# EAGLE schematic nrf52_dev (EAGLE 9.6.2)
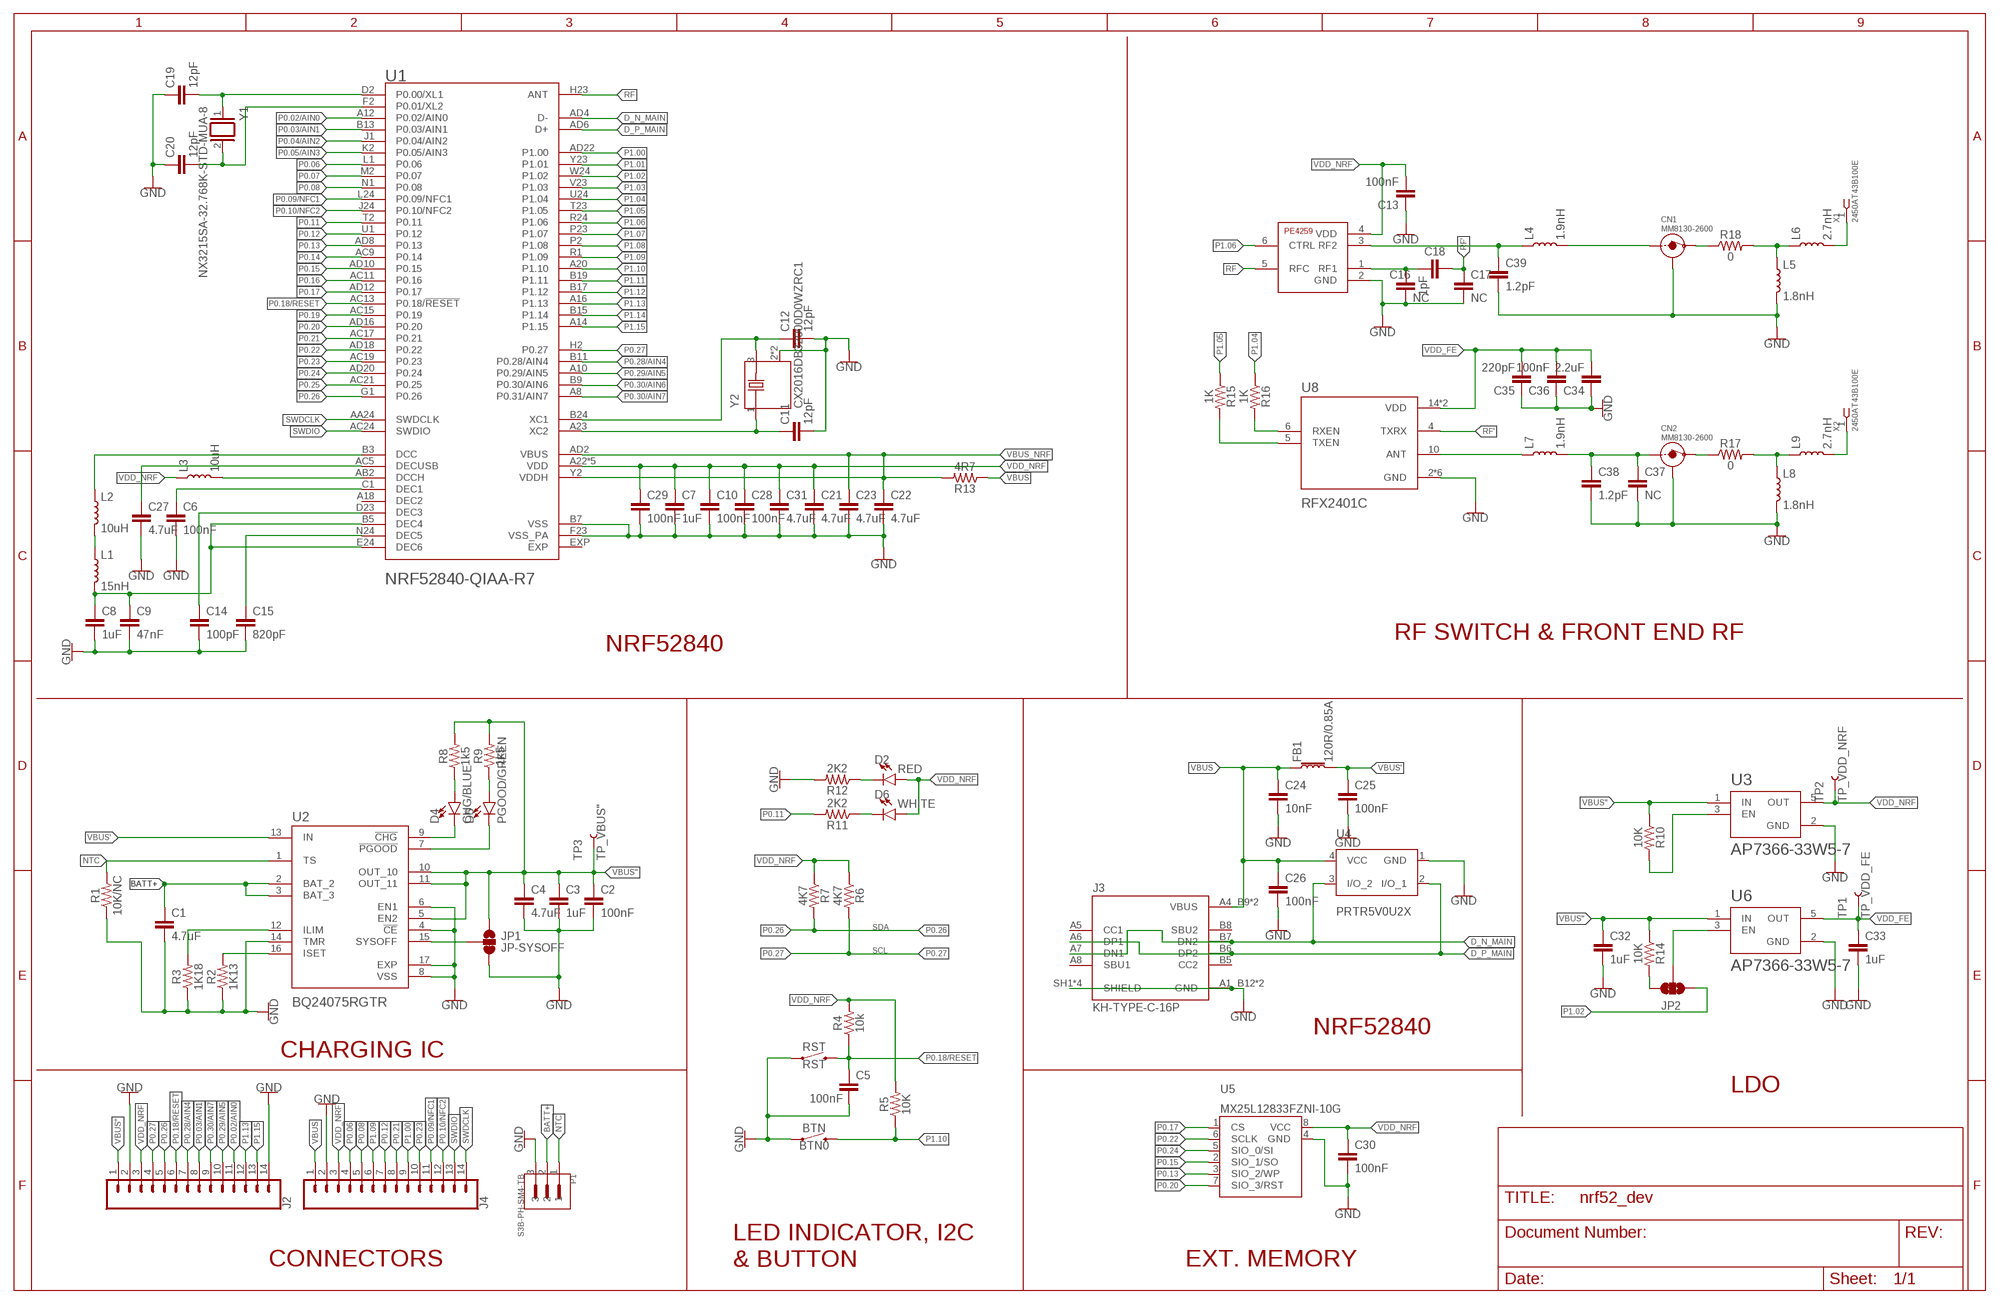
[diagram p0: schematic, sheet 1]

## Parts
BTN  BTN0  MOMENTARY-SWITCH-SPST-SMD-6.0X3.5MM  [TACTILE_SWITCH_SMD_6.0X3.5MM]
C1  4.7uF  4.7UF-0805-50V-(10%)  [0805]
C2  100nF  0.1UF-0603-25V-(+80/-20%)  [0603]
C3  1uF  0.1UF-0603-25V-(+80/-20%)  [0603]
C4  4.7uF  4.7UF-0805-50V-(10%)  [0805]
C5  100nF  0.1UF-0402-10V-10%-X7R  [0402]
C6  100nF  0.1UF-0402-10V-10%-X7R  [0402]
C7  1uF  0.1UF-0402-10V-10%-X7R  [0402]
C8  1uF  0.1UF-0402-10V-10%-X7R  [0402]
C9  47nF  0.1UF-0402-10V-10%-X7R  [0402]
C10  100nF  0.1UF-0402-10V-10%-X7R  [0402]
C11  12pF  0.1UF-0603-25V-(+80/-20%)  [0603]
C12  12pF  0.1UF-0603-25V-(+80/-20%)  [0603]
C13  100nF  0.1UF-0402-10V-10%-X7R  [0402]
C14  100pF  0.1UF-0402-10V-10%-X7R  [0402]
C15  820pF  0.1UF-0402-10V-10%-X7R  [0402]
C16  NC  0.1UF-0402-10V-10%-X7R  [0402]
C17  NC  0.1UF-0402-10V-10%-X7R  [0402]
C18  1pF  0.1UF-0603-25V-(+80/-20%)  [0603]
C19  12pF  0.1UF-0402-10V-10%-X7R  [0402]
C20  12pF  0.1UF-0402-10V-10%-X7R  [0402]
C21  4.7uF  0.1UF-0402-10V-10%-X7R  [0402]
C22  4.7uF  0.1UF-0402-10V-10%-X7R  [0402]
C23  4.7uF  0.1UF-0402-10V-10%-X7R  [0402]
C24  10nF  0.1UF-0402-10V-10%-X7R  [0402]
C25  100nF  0.1UF-0402-10V-10%-X7R  [0402]
C26  100nF  0.1UF-0402-10V-10%-X7R  [0402]
C27  4.7uF  0.1UF-0603-25V-(+80/-20%)  [0603]
C28  100nF  0.1UF-0402-10V-10%-X7R  [0402]
C29  100nF  0.1UF-0402-10V-10%-X7R  [0402]
C30  100nF  0.1UF-0402-10V-10%-X7R  [0402]
C31  4.7uF  0.1UF-0402-10V-10%-X7R  [0402]
C32  1uF  0.1UF-0603-25V-(+80/-20%)  [0603]
C33  1uF  0.1UF-0603-25V-(+80/-20%)  [0603]
C34  2.2uF  0.1UF-0402-10V-10%-X7R  [0402]
C35  220pF  0.1UF-0402-10V-10%-X7R  [0402]
C36  100nF  0.1UF-0402-10V-10%-X7R  [0402]
C37  NC  0.1UF-0402-10V-10%-X7R  [0402]
C38  1.2pF  0.1UF-0402-10V-10%-X7R  [0402]
C39  1.2pF  0.1UF-0402-10V-10%-X7R  [0402]
CN1  MM8130-2600  [MM8130-2600]
CN2  MM8130-2600  [MM8130-2600]
D2  RED  LED0603  [LED-0603]
D4  CHG/BLUE  LED0603  [LED-0603]
D5  PGOOD/GREEN  LED0603  [LED-0603]
D6  WHITE  LED0603  [LED-0603]
FB1  120R/0.85A  FERRITE_BEAD  [0402]
J2  CONN_14NO_SILK  [1X14_NO_SILK]
J3  KH-TYPE-C-16P  [KINGHELM_KH-TYPE-C-16P]
J4  CONN_14NO_SILK  [1X14_NO_SILK]
JP1  JP-SYSOFF  JUMPER-SMT_3_1-NC_TRACE_SILK  [SMT-JUMPER_3_1-NC_TRACE_SILK]
JP2  JP_EN1  JUMPER-SMT_3_1-NC_TRACE_SILK  [SMT-JUMPER_3_1-NC_TRACE_SILK]
L1  15nH  INDUCTOR-0402-3.9NH  [0402]
L2  10uH  39NH-0603  [0603]
L3  10uH  39NH-0603  [0603]
L4  1.9nH  INDUCTOR-0402-3.9NH  [0402]
L5  1.8nH  39NH-0603  [0603]
L6  2.7nH  39NH-0603  [0603]
L7  1.9nH  INDUCTOR-0402-3.9NH  [0402]
L8  1.8nH  39NH-0603  [0603]
L9  2.7nH  39NH-0603  [0603]
P1  S3B-PH-SM4-TB  [JST_S3B-PH-SM4-TB]
R1  10K/NC  RESISTOR0603  [0603]
R2  1K13  RESISTOR0603  [0603]
R3  1K18  RESISTOR0603  [0603]
R4  10k  RESISTOR0402  [0402]
R5  10K  RESISTOR0402  [0402]
R6  4K7  0OHM-0402-1/10W  [0402]
R7  4K7  0OHM-0402-1/10W  [0402]
R8  1k5  0OHM-0402-1/10W  [0402]
R9  1k5  0OHM-0402-1/10W  [0402]
R10  10K  RESISTOR0603  [0603]
R11  2K2  0OHM-0402-1/10W  [0402]
R12  2K2  0OHM-0402-1/10W  [0402]
R13  4R7  RESISTOR0603  [0603]
R14  10K  RESISTOR0603  [0603]
R15  1K  0OHM-0402-1/10W  [0402]
R16  1K  0OHM-0402-1/10W  [0402]
R17  0  0OHM-0402-1/10W  [0402]
R18  0  0OHM-0402-1/10W  [0402]
RST  RST  MOMENTARY-SWITCH-SPST-SMD-6.0X3.5MM  [TACTILE_SWITCH_SMD_6.0X3.5MM]
TP1  TP_VDD_FE  TEST-POINT3X4  [PAD.03X.04]
TP2  TP_VDD_NRF  TEST-POINT3X4  [PAD.03X.04]
TP3  TP_VBUS''  TEST-POINT3X4  [PAD.03X.04]
U1  NRF52840-QIAA-R7  [NORDIC_NRF52840-QIAA-R7]
U2  BQ24075RGTR  [QFN50P300X300X100-17N]
U3  AP7366-33W5-7  [SOT95P285X140-5N]
U4  PRTR5V0U2X  [SOT190P230X110-4N]
U5  MX25L12833FZNI-10G  [SON127P500X600X80-9N]
U6  AP7366-33W5-7  [SOT95P285X140-5N]
U7  PE4259  [SOT65P210X110-6N]
U8  RFX2401C  [QFN50P300X300X60-17N]
X1  2450AT43B100E  [2450AT43B100]
X2  2450AT43B100E  [2450AT43B100]
Y1  NX3215SA-32.768K-STD-MUA-8  [XTAL_NX3215SA-32.768K-STD-MUA-8]
Y2  CX2016DB32000D0WZRC1  [OSCCC200X160X45N]

## Nets
BATT+: C1.1 P1.2 U2.2(BAT_2) U2.3(BAT_3)
D_N_MAIN: J3.A7(DN1) J3.B7(DN2) U1.AD4(D-) U4.3(I/O_2)
D_P_MAIN: J3.A6(DP1) J3.B6(DP2) U1.AD6(D+) U4.2(I/O_1)
GND: BTN.1 C1.2 C2.2 C3.2 C4.2 C5.2 C6.2 C7.2 C8.2 C9.2 C10.2 C11.2 C12.2 C13.1 C14.2 C15.2 C16.2 C17.2 C19.1 C20.1 C21.2 C22.2 C23.2 C24.2 C25.2 C26.2 C27.2 C28.2 C29.2 C30.2 C31.2 C32.2 C33.2 C34.1 C35.1 C36.1 C37.2 C38.2 C39.2 CN1.1 CN1.2 CN1.3 CN1.4 CN2.1 CN2.2 CN2.3 CN2.4 J2.2 J2.14 J3.A1_B12(GND) J3.A12_B1(GND) J3.SH1(SHIELD) J3.SH2(SHIELD) J3.SH3(SHIELD) J3.SH4(SHIELD) J4.2 JP1.3 L5.2 L8.2 P1.3 R1.1 R2.1 R3.1 R12.2 RST.1 U1.B7(VSS) U1.F23(VSS_PA) U2.4(!CE) U2.6(EN1) U2.8(VSS) U2.14(TMR) U2.17(EXP) U3.2(GND) U4.1(GND) U5.4(GND) U6.2(GND) U7.2(GND) U8.2(GND) U8.3(GND) U8.8(GND) U8.9(GND) U8.11(GND) U8.17(GND) Y2.2(GND) Y2.4(GND)
N$1: JP2.2 U6.3(EN)
N$2: C27.1 U1.AC5(DECUSB)
N$3: JP2.3 R14.2
N$5: D4.C U2.9(!CHG)
N$7: L3.2 U1.AB2(DCCH)
N$8: L1.1 L2.2
N$9: C6.1 U1.C1(DEC1)
N$10: L2.1 U1.B3(DCC)
N$11: C20.2 U1.F2(P0.01/XL2) Y1.2
N$13: C14.1 U1.D23(DEC3)
N$14: C15.1 U1.N24(DEC5)
N$15: C8.1 C9.1 L1.2 U1.B5(DEC4) U1.E24(DEC6)
N$16: C19.2 U1.D2(P0.00/XL1) Y1.1
N$17: C11.1 U1.A23(XC2) Y2.1(HOT_1)
N$18: C12.1 U1.B24(XC1) Y2.3(HOT_3)
N$19: R16.2 U8.6(RXEN)
N$20: R15.2 U8.5(TXEN)
N$21: D6.C R11.1
N$38: D5.C U2.7(!PGOOD)
N$40: R10.2 U3.3(EN)
N$42: D2.C R12.1
N$43: C16.1 C18.2 U7.1(RF1)
N$44: CN1.OUT R18.1
N$45: R2.2 U2.16(ISET)
N$46: L5.1 L6.1 R18.2
N$47: JP1.2 U2.15(SYSOFF)
N$48: L6.2 X1.1
N$49: R3.2 U2.12(ILIM)
N$50: D4.A R8.1
N$51: D5.A R9.1
N$52: CN1.IN L4.2
N$53: C39.1 L4.1 U7.3(RF2)
N$54: C37.1 C38.1 CN2.IN L7.2
N$55: CN2.OUT R17.1
N$56: L8.1 L9.1 R17.2
N$57: L9.2 X2.1
N$59: L7.1 U8.10(ANT)
NTC: P1.1 R1.2 U2.1(TS)
P0.02/AIN0: J2.11 U1.A12(P0.02/AIN0)
P0.03/AIN1: J2.8 U1.B13(P0.03/AIN1)
P0.04/AIN2: U1.J1(P0.04/AIN2)
P0.05/AIN3: U1.K2(P0.05/AIN3)
P0.06: J4.4 U1.L1(P0.06)
P0.07: U1.M2(P0.07)
P0.08: J4.5 U1.N1(P0.08)
P0.09/NFC1: J4.11 U1.L24(P0.09/NFC1)
P0.10/NFC2: J4.12 U1.J24(P0.10/NFC2)
P0.11: R11.2 U1.T2(P0.11)
P0.12: J4.7 U1.U1(P0.12)
P0.13: U1.AD8(P0.13) U5.3(SIO_2/WP)
P0.14: U1.AC9(P0.14)
P0.15: U1.AD10(P0.15) U5.2(SIO_1/SO)
P0.16: U1.AC11(P0.16)
P0.17: U1.AD12(P0.17) U5.1(CS)
P0.18/RESET: C5.1 J2.6 R4.1 RST.2 U1.AC13(P0.18/!RESET)
P0.19: U1.AC15(P0.19)
P0.20: U1.AD16(P0.20) U5.7(SIO_3/RST)
P0.21: J4.8 U1.AC17(P0.21)
P0.22: U1.AD18(P0.22) U5.6(SCLK)
P0.23: J4.10 U1.AC19(P0.23)
P0.24: U1.AD20(P0.24) U5.5(SIO_0/SI)
P0.25: U1.AC21(P0.25)
P0.26: J2.5 R7.2 U1.G1(P0.26)
P0.27: J2.4 R6.2 U1.H2(P0.27)
P0.28/AIN4: J2.7 U1.B11(P0.28/AIN4)
P0.29/AIN5: J2.10 U1.A10(P0.29/AIN5)
P0.30/AIN6: U1.B9(P0.30/AIN6)
P0.30/AIN7: J2.9 U1.A8(P0.31/AIN7)
P1.00: J4.9 U1.AD22(P1.00)
P1.01: U1.Y23(P1.01)
P1.02: JP2.1 U1.W24(P1.02)
P1.03: U1.V23(P1.03)
P1.04: R16.1 U1.U24(P1.04)
P1.05: R15.1 U1.T23(P1.05)
P1.06: U1.R24(P1.06) U7.6(CTRL)
P1.07: U1.P23(P1.07)
P1.08: U1.P2(P1.08)
P1.09: J4.6 U1.R1(P1.09)
P1.10: BTN.2 R5.1 U1.A20(P1.10)
P1.11: U1.B19(P1.11)
P1.12: U1.B17(P1.12)
P1.13: J2.12 U1.A16(P1.13)
P1.14: U1.B15(P1.14)
P1.15: J2.13 U1.A14(P1.15)
RF: U1.H23(ANT) U7.5(RFC)
RF': C17.1 C18.1 U8.4(TXRX)
SWDCLK: J4.14 U1.AA24(SWDCLK)
SWDIO: J4.13 U1.AC24(SWDIO)
VBUS: C24.1 C26.1 FB1.1 J3.A4_B9(VBUS) J3.A9_B4(VBUS) J4.1 R13.1 U4.4(VCC)
VBUS': C25.1 FB1.2 U2.13(IN)
VBUS'': C2.1 C3.1 C4.1 C32.1 J2.1 JP1.1 R8.2 R9.2 R10.1 R14.1 TP3.P$1 U2.5(EN2) U2.10(OUT_10) U2.11(OUT_11) U3.1(IN) U6.1(IN)
VBUS_NRF: C22.1 C23.1 R13.2 U1.AD2(VBUS) U1.Y2(VDDH)
VDD_FE: C33.1 C34.2 C35.2 C36.2 TP1.P$1 U6.5(OUT) U8.14(VDD) U8.16(VDD)
VDD_NRF: C7.1 C10.1 C13.2 C21.1 C28.1 C29.1 C30.1 C31.1 D2.A D6.A J2.3 J4.3 L3.1 R4.2 R5.2 R6.1 R7.1 TP2.P$1 U1.A22(VDD) U1.AD14(VDD) U1.AD23(VDD) U1.B1(VDD) U1.W1(VDD) U3.5(OUT) U5.8(VCC) U7.4(VDD)
Unconnected: J3.A5(CC1) J3.A8(SBU1) J3.B5(CC2) J3.B8(SBU2)

## Notes on the sheet
- RF SWITCH & FRONT END RF
- NRF52840
- SDA
- SCL
- NRF52840
- CHARGING IC
- LDO
- CONNECTORS
- LED INDICATOR, I2C
  & BUTTON
- EXT. MEMORY

## Power pins joined to a net without a drawn wire
DEC2: U1.A18(DEC2)
EXP: U1.EXP

## Library data of the parts
BTN RST = SparkFun-Switches:MOMENTARY-SWITCH-SPST: Momentary Switch (Pushbutton) - SPST Normally-open (NO) SPST momentary switches (buttons, pushbuttons). Variants PTH-12MM - 12mm square, through-hole Momentary Pushbutton Switch - 12mm Square <https://www.sparkfun.com/products/9190> (COM-09190) PTH-6.0MM, PTH-6.0MM-KIT - 6.0mm square, through-hole Mini Pushbutton Switch <https://www.sparkfun.com/products/97> (COM-00097) KIT package intended for soldering kit's - only one side of pads' copper is exposed. PTH-RIGHT-ANGLE-KIT - Right-angle, through-hole Right Angle Tactile Button <https://www.sparkfun.com/products/10791> - Used on SparkFun BigTime Watch Kit <https://www.sparkfun.com/products/11734> SMD-12MM - 12mm square, surface-mount Tactile Button - SMD (12mm) <https://www.sparkfun.com/products/12993> (COM-12993) Used on SparkFun PicoBoard <https://www.sparkfun.com/products/11888> SMD-4.5MM - 4.5mm Square Trackball Switch Used on SparkFun Blackberry Trackballer Breakout <https://www.sparkfun.com/products/13169> SMD-4.6MMX2.8MM - 4.60mm x 2.80mm, surface mount Used on SparkFun SAMD21 Mini Breakout <https://www.sparkfun.com/products/13664> SMD-5.2MM, SMD-5.2-REDUNDANT - 5.2mm square, surface-mount Mini Pushbutton Switch - SMD <https://www.sparkfun.com/products/8720> (COM-08720) Used on Arduino Pro Mini <https://www.sparkfun.com/products/11114> REDUNDANT package connects both switch circuits together SMD-6.0X3.5MM - 6.0 x 3.5mm, surface mount Momentary Reset Switch SMD <https://www.sparkfun.com/products/8229> (COM-08229) SMD-6.2MM-TALL - 6.2mm square, surface mount Tactile Button - SMD (6mm) <https://www.sparkfun.com/products/12992> Used on SparkFun Digital Sandbox <https://www.sparkfun.com/products/12651> SMD-RIGHT-ANGLE - Right-angle, surface mount Used on SparkFun Block for Intel® Edison - Arduino <https://www.sparkfun.com/products/13036>; PROD_ID: SWCH-14278; SF_SKU: COM-08229
C1 C4 = SparkFun-Capacitors:4.7UF: 4.7µF ceramic capacitors A capacitor is a passive two-terminal electrical component used to store electrical energy temporarily in an electric field.; PROD_ID: CAP-15457
C2 C3 C11 C12 C18 C27 C32 C33 = SparkFun-Capacitors:0.1UF: 0.1µF ceramic capacitors A capacitor is a passive two-terminal electrical component used to store electrical energy temporarily in an electric field.; PROD_ID: CAP-00810; VALUE: 0.1uF
C5-C10 C13-C17 C19-C26 C28-C31 C34-C39 = SparkFun-Capacitors:0.1UF: 0.1µF ceramic capacitors A capacitor is a passive two-terminal electrical component used to store electrical energy temporarily in an electric field.; PROD_ID: CAP-15083; VALUE: 0.1uF
CN1 CN2 = MM8130-2600:MM8130-2600; DESCRIPTION: SWF Connector Receptacle, Female Socket 50Ohm Surface Mount Solder; MF: Murata; MP: MM8130-2600; PACKAGE: None
D2 D4-D6 = SparkFun-LED:LED: LED (Generic) Standard schematic elements and footprints for 5mm, 3mm, 1206, and 0603 sized LEDs. Generic LEDs with no color specified.
FB1 = SparkFun-Coils:FERRITE_BEAD: Ferrite Bead (blocks, cores, rings, chokes, etc.) Inductor with layers of ferrite used to suppress high frequencies. Often used to isolate high frequency noise. SparkFun Products: IOIO-OTG - V2.2 <https://www.sparkfun.com/products/13613> SparkFun SAMD21 Mini Breakout <https://www.sparkfun.com/products/13664> SparkFun 6 Degrees of Freedom Breakout - LSM6DS3 <https://www.sparkfun.com/products/13339> SparkFun SAMD21 Dev Breakout <https://www.sparkfun.com/products/13672>
J2 J4 = SparkFun-Connectors:CONN_14: Multi connection point. Often used as Generic Header-pin footprint for 0.1 inch spaced/style header connections On any of the 0.1 inch spaced packages, you can populate with these: Break Away Headers - Straight <https://www.sparkfun.com/products/116> (PRT-00116) Break Away Male Headers - Right Angle <https://www.sparkfun.com/products/553> (PRT-00553) Female Headers <https://www.sparkfun.com/products/115> (PRT-00115) Break Away Headers - Machine Pin <https://www.sparkfun.com/products/117> (PRT-00117) Break Away Female Headers - Swiss Machine Pin <https://www.sparkfun.com/products/743> (PRT-00743) For SCREWTERMINALS and SPRING TERMINALS visit here: Screw Terimnals on SparkFun.com <https://www.sparkfun.com/search/results?term=Screw+Terminals> (5mm/3.5mm/2.54mm spacing) This device is also useful as a general connection point to wire up your design to another part of your project. Our various solder wires solder well into these plated through hole pads. Hook-Up Wire - Assortment (Stranded, 22 AWG) <https://www.sparkfun.com/products/11375> (PRT-11375) Hook-Up Wire - Assortment (Solid Core, 22 AWG) <https://www.sparkfun.com/products/11367> (PRT-11367) View the entire wire category on our website here <https://www.sparkfun.com/categories/141> Special notes: Molex polarized connector foot print use with SKU : PRT-08231 with associated crimp pins and housings. 1MM SMD Version SKU: PRT-10208 NOTES ON THE VARIANTS LOCK and LOCK_LONGPADS... This footprint was designed to help hold the alignment of a through-hole component (i.e. 6-pin header) while soldering it into place. You may notice that each hole has been shifted either up or down by 0.005 of an inch from it's more standard position (which is a perfectly straight line). This slight alteration caused the pins (the squares in the middle) to touch the edges of the holes. Because they are alternating, it causes a "brace" to hold the component in place. 0.005 has proven to be the perfect amount of "off-center" position when using our standard breakaway headers. Although looks a little odd when you look at the bare footprint, once you have a header in there, the alteration is very hard to notice. Also,if you push a header all the way into place, it is covered up entirely on the bottom side.
J3 = KH-TYPE-C-16P:KH-TYPE-C-16P: Check availability <https://pricing.snapeda.com/parts/KH-TYPE-C-16P/kinghelm/view-part?ref=eda>; AVAILABILITY: Not in stock; MF: kinghelm; MP: KH-TYPE-C-16P; PACKAGE: None; PRICE: None
JP1 JP2 = SparkFun-Jumpers:JUMPER-SMT_3_1-NC_TRACE: Normally closed trace jumper (1 of 2 connections) This jumper has a trace between two pads so it's normally closed (NC). The other connection is normally open (NO). Use a razor knife to open the connection. For best results follow the IPC guidelines for cutting traces: Cutout at least 0.063 mm (0.005 in). Remove all loose material to clean up the cut area. Seal the cut with an approved epoxy. Reapply solder to reclose the connection, or to close the NO connection.
L1 L4 L7 = SparkFun-Coils:INDUCTOR: Inductors Resist changes in electrical current. Basically a coil of wire. SparkFun Products: SparkFun Load Cell Amplifier - HX711 <https://www.sparkfun.com/products/13879> IOIO-OTG - V2.2 <https://www.sparkfun.com/products/13613>; PROD_ID: NDUC-13457; VALUE: 3.9NH
L2 L3 L5 L6 L8 L9 = SparkFun-Coils:39NH; PROD_ID: NDUC-14091; VALUE: 39nH
P1 = S3B-PH-SM4-TB:S3B-PH-SM4-TB: CONN HEADER PH SIDE 3POS 2MM SMD Check availability <https://pricing.snapeda.com/parts/S3B-PH-SM4-TB/JST%20Sales/view-part?ref=eda>; AVAILABILITY: In Stock; DESCRIPTION: Connector Header Surface Mount, Right Angle 3 position 0.079 (2.00mm); MF: JST Sales; MP: S3B-PH-SM4-TB; PACKAGE: None; PRICE: None; PURCHASE-URL: https://pricing.snapeda.com/search?q=S3B-PH-SM4-TB&ref=eda
R1-R5 R10 R13 R14 = SparkFun-Resistors:RESISTOR: Generic Resistor Package
R6-R9 R11 R12 R15 R16 = SparkFun-Resistors:0OHM: 0Ω resistor A resistor is a passive two-terminal electrical component that implements electrical resistance as a circuit element. Resistors act to reduce current flow, and, at the same time, act to lower voltage levels within circuits. - Wikipedia; PROD_ID: RES-14244; VALUE: 0
R17 R18 = SparkFun-Resistors:0OHM: 0Ω resistor A resistor is a passive two-terminal electrical component that implements electrical resistance as a circuit element. Resistors act to reduce current flow, and, at the same time, act to lower voltage levels within circuits. - Wikipedia; PROD_ID: RES-14244
TP1-TP3 = SparkFun-Connectors:TEST-POINT: SparkFun Test Points Bare copper test points for troubleshooting or In-Circuit-Testing. These are used by our Production team for verifying production board runs using pogo-pins on test beds. SparkFun Products: SparkFun LSM9DS1 Breakout <https://www.sparkfun.com/products/13284> SparkFun PSOC <https://www.sparkfun.com/products/13714> SparkFun Load Cell Amplifier <https://www.sparkfun.com/products/13879>
U1 = NRF52840-QIAA-R7-custom:NRF52840-QIAA-R7: IC RF TxRx + MCU 802.15.4, Bluetooth Bluetooth v5.0, Thread, Zigbee 2.4GHz 73-VFQFN Dual Rows, Exposed Pad Check availability <https://pricing.snapeda.com/parts/NRF52840-QIAA-R7/Nordic%20Semiconductor/view-part?ref=eda>; AVAILABILITY: In Stock; DESCRIPTION: IC RF TxRx + MCU 802.15.4, Bluetooth Bluetooth v5.0, Thread, Zigbee® 2.4GHz 73-VFQFN Dual Rows, Exposed Pad; MF: Nordic Semiconductor; MP: NRF52840-QIAA-R7; PACKAGE: QFN-73 Nordic Semiconductor; PRICE: None; PURCHASE-URL: https://pricing.snapeda.com/search/part/NRF52840-QIAA-R7/?ref=eda
U2 = BQ24075RGTR:BQ24075RGTR: Standalone 1-cell 1.5-A linear charger, Power Path, 4.2-V VBAT and 5.5-V VOUT 16-VQFN -40 to 85; DESCRIPTION: Standalone 1-cell 1.5-A linear battery charger, Power Path, 4.2-V VBAT and 5.5-V VOUT; DIGI-KEY_PART_NUMBER: 296-38874-2-ND; MF: Texas Instruments; MP: BQ24075RGTR; PACKAGE: VQFN-16 Texas Instruments; PURCHASE-URL: https://pricing.snapeda.com/search?q=BQ24075RGTR&ref=eda
U3 U6 = AP7366-33W5-7:AP7366-33W5-7: Linear Voltage Regulator IC 1 Output 600mA SOT-25 Check availability <https://pricing.snapeda.com/parts/AP7366-33W5-7/Diodes%20Zetex/view-part?ref=eda>; AVAILABILITY: In Stock; DESCRIPTION: LDO Regulator Pos 3.3V 0.6A 5-Pin SOT-25 T/R; MF: Diodes Zetex; MP: AP7366-33W5-7; PACKAGE: None; PRICE: None; PURCHASE-URL: https://pricing.snapeda.com/search?q=AP7366-33W5-7&ref=eda
U4 = PRTR5V0U2X-custom:PRTR5V0U2X: DIODE, TVS, DUAL, SOT-143B; Diode Type: TVS, Bidirectional; Voltage, Stand-off: 5.5V; Voltage, Vbr: 9V; Termination T...; DESCRIPTION: - Clamp - Ipp Tvs Diode Surface Mount SOT-143B; MF: Nexperia USA; MP: PRTR5V0U2X; PACKAGE: TO-253-4 Nexperia USA Inc.
U5 = MX25L12833FZNI:MX25L12833FZNI-10G
U7 = SOT65P210X110-6N:PE4259
U8 = RFX2401C:RFX2401C: None Check availability <https://pricing.snapeda.com/parts/RFX2401C/Skyworks%20Solutions/view-part?ref=eda>; AVAILABILITY: In Stock; DESCRIPTION: RF Front End 2.4GHz ~ 2.5GHz 802.15.4, Zigbee® 16-QFN (3x3); MF: Skyworks Solutions; MP: RFX2401C; PACKAGE: UFQFN-16 Skyworks Solutions; PRICE: None; PURCHASE-URL: https://pricing.snapeda.com/search?q=RFX2401C&ref=eda
X1 X2 = 2450AT43B100E:2450AT43B100E: Antenne SMD Doc constructeur <http://geii/magasin/pdf/2450AT43B100E.pdf> GEII/IUT ANGERS Check availability <https://pricing.snapeda.com/parts/2450AT43B100E/Johanson/view-part?ref=eda>; AVAILABILITY: In Stock; DESCRIPTION: Antenna SMD -0.5dBi Gain 2500MHz Automotive 4-Pin SMD T/R; MF: Johanson; MP: 2450AT43B100E; PACKAGE: None; PRICE: None
Y1 = NX3215SA-32.768K-STD-MUA-8:NX3215SA-32.768K-STD-MUA-8; DESCRIPTION: 32.768 kHz ±20ppm Crystal 12.5pF 70 kOhms 2-SMD, No Lead; DIGI-KEY_PART_NUMBER: 644-1156-2-ND; MF: NDK America,; MP: NX3215SA-32.768K-STD-MUA-8; PACKAGE: SMD-2 NDK; PURCHASE-URL: https://pricing.snapeda.com/search/part/NX3215SA-32.768K-STD-MUA-8/?ref=eda
Y2 = CX2016DB32000D0WZRC1:CX2016DB32000D0WZRC1: Crystal 32.0000mhz 8pf Smd Check availability <https://pricing.snapeda.com/parts/CX2016DB32000D0WZRC1/Kyocera%20International/view-part?ref=eda>; AVAILABILITY: In Stock; DESCRIPTION: 32 MHz ±25ppm Crystal 8pF 60 Ohms 4-SMD, No Lead; MF: Kyocera International; MP: CX2016DB32000D0WZRC1; PACKAGE: SMD-4 AVX; PRICE: None; PURCHASE-URL: https://pricing.snapeda.com/search/part/CX2016DB32000D0WZRC1/?ref=eda